# Altium schematic sheet FETs.SchDoc
size A4
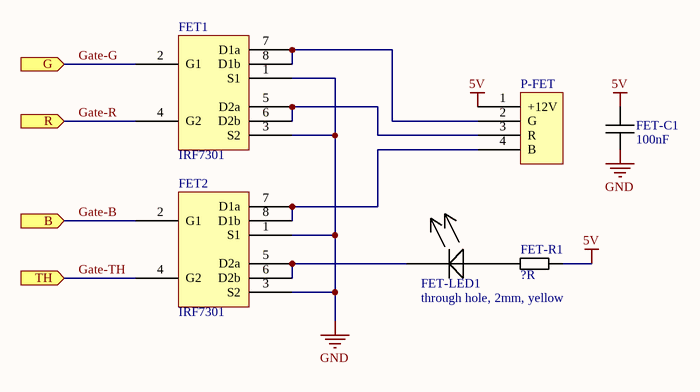
[diagram p0: FETs.SchDoc]

## Parts
FET1  IRF7301  [SOIC-8]
FET2  IRF7301  [SOIC-8]
FET-C1  100nF  [C 0805 / 2012]
FET-LED1  through hole, 2mm, yellow  [LED 3mm]
FET-R1  ?R  [R 0805 / 2012]
P-FET  LED strip RGB  [LED strip RGB connector]  (value not drawn)

## Ports
B (in), G (in), R (in), TH (in)

## Nets
5V: FET-C1.1 FET-R1.2 P-FET.1(+12V)
GND: FET1.1(S1) FET1.3(S2) FET2.1(S1) FET2.3(S2) FET-C1.2
Gate-B: FET2.2(G1) ; port B
Gate-G: FET1.2(G1) ; port G
Gate-R: FET1.4(G2) ; port R
Gate-TH: FET2.4(G2) ; port TH
NetFET1_5: FET1.5(D2a) FET1.6(D2b) P-FET.3(R)
NetFET1_7: FET1.7(D1a) FET1.8(D1b) P-FET.2(G)
NetFET2_5: FET2.5(D2a) FET2.6(D2b) FET-LED1.2(-)
NetFET2_7: FET2.7(D1a) FET2.8(D1b) P-FET.4(B)
NetFET-LED1_1: FET-LED1.1(+) FET-R1.1

## Library data of the parts
FET-C1 = Capacitor
FET-LED1 = LED
FET-R1 = Resistor